# Altium schematic sheet AMU-S04-V00-Microcontroller.SchDoc: AMU Microcontroller
size A3; DrawnBy: Thomas Benedetti; DocumentNumber: 4; Revision: 01; SheetNumber: 5; SheetTotal: 25; Version: 01; Project: AMU 2020; PageSetup: Record=PageOptions|CenterHorizontal=True|CenterVertical=True|PrintScale=0.97|XCorrection=1.00|YCorrection=1.00|PrintKind=0|BorderSize=5000000|LeftOffset=0|BottomOffset=0|Orientation=2|PaperLength=1000|PaperWidth=1000|Scale=100|PaperSource=7|PrintQuality=-4|MediaType=1|DitherType=10|PaperKind=A4|PrintScaleMode=1
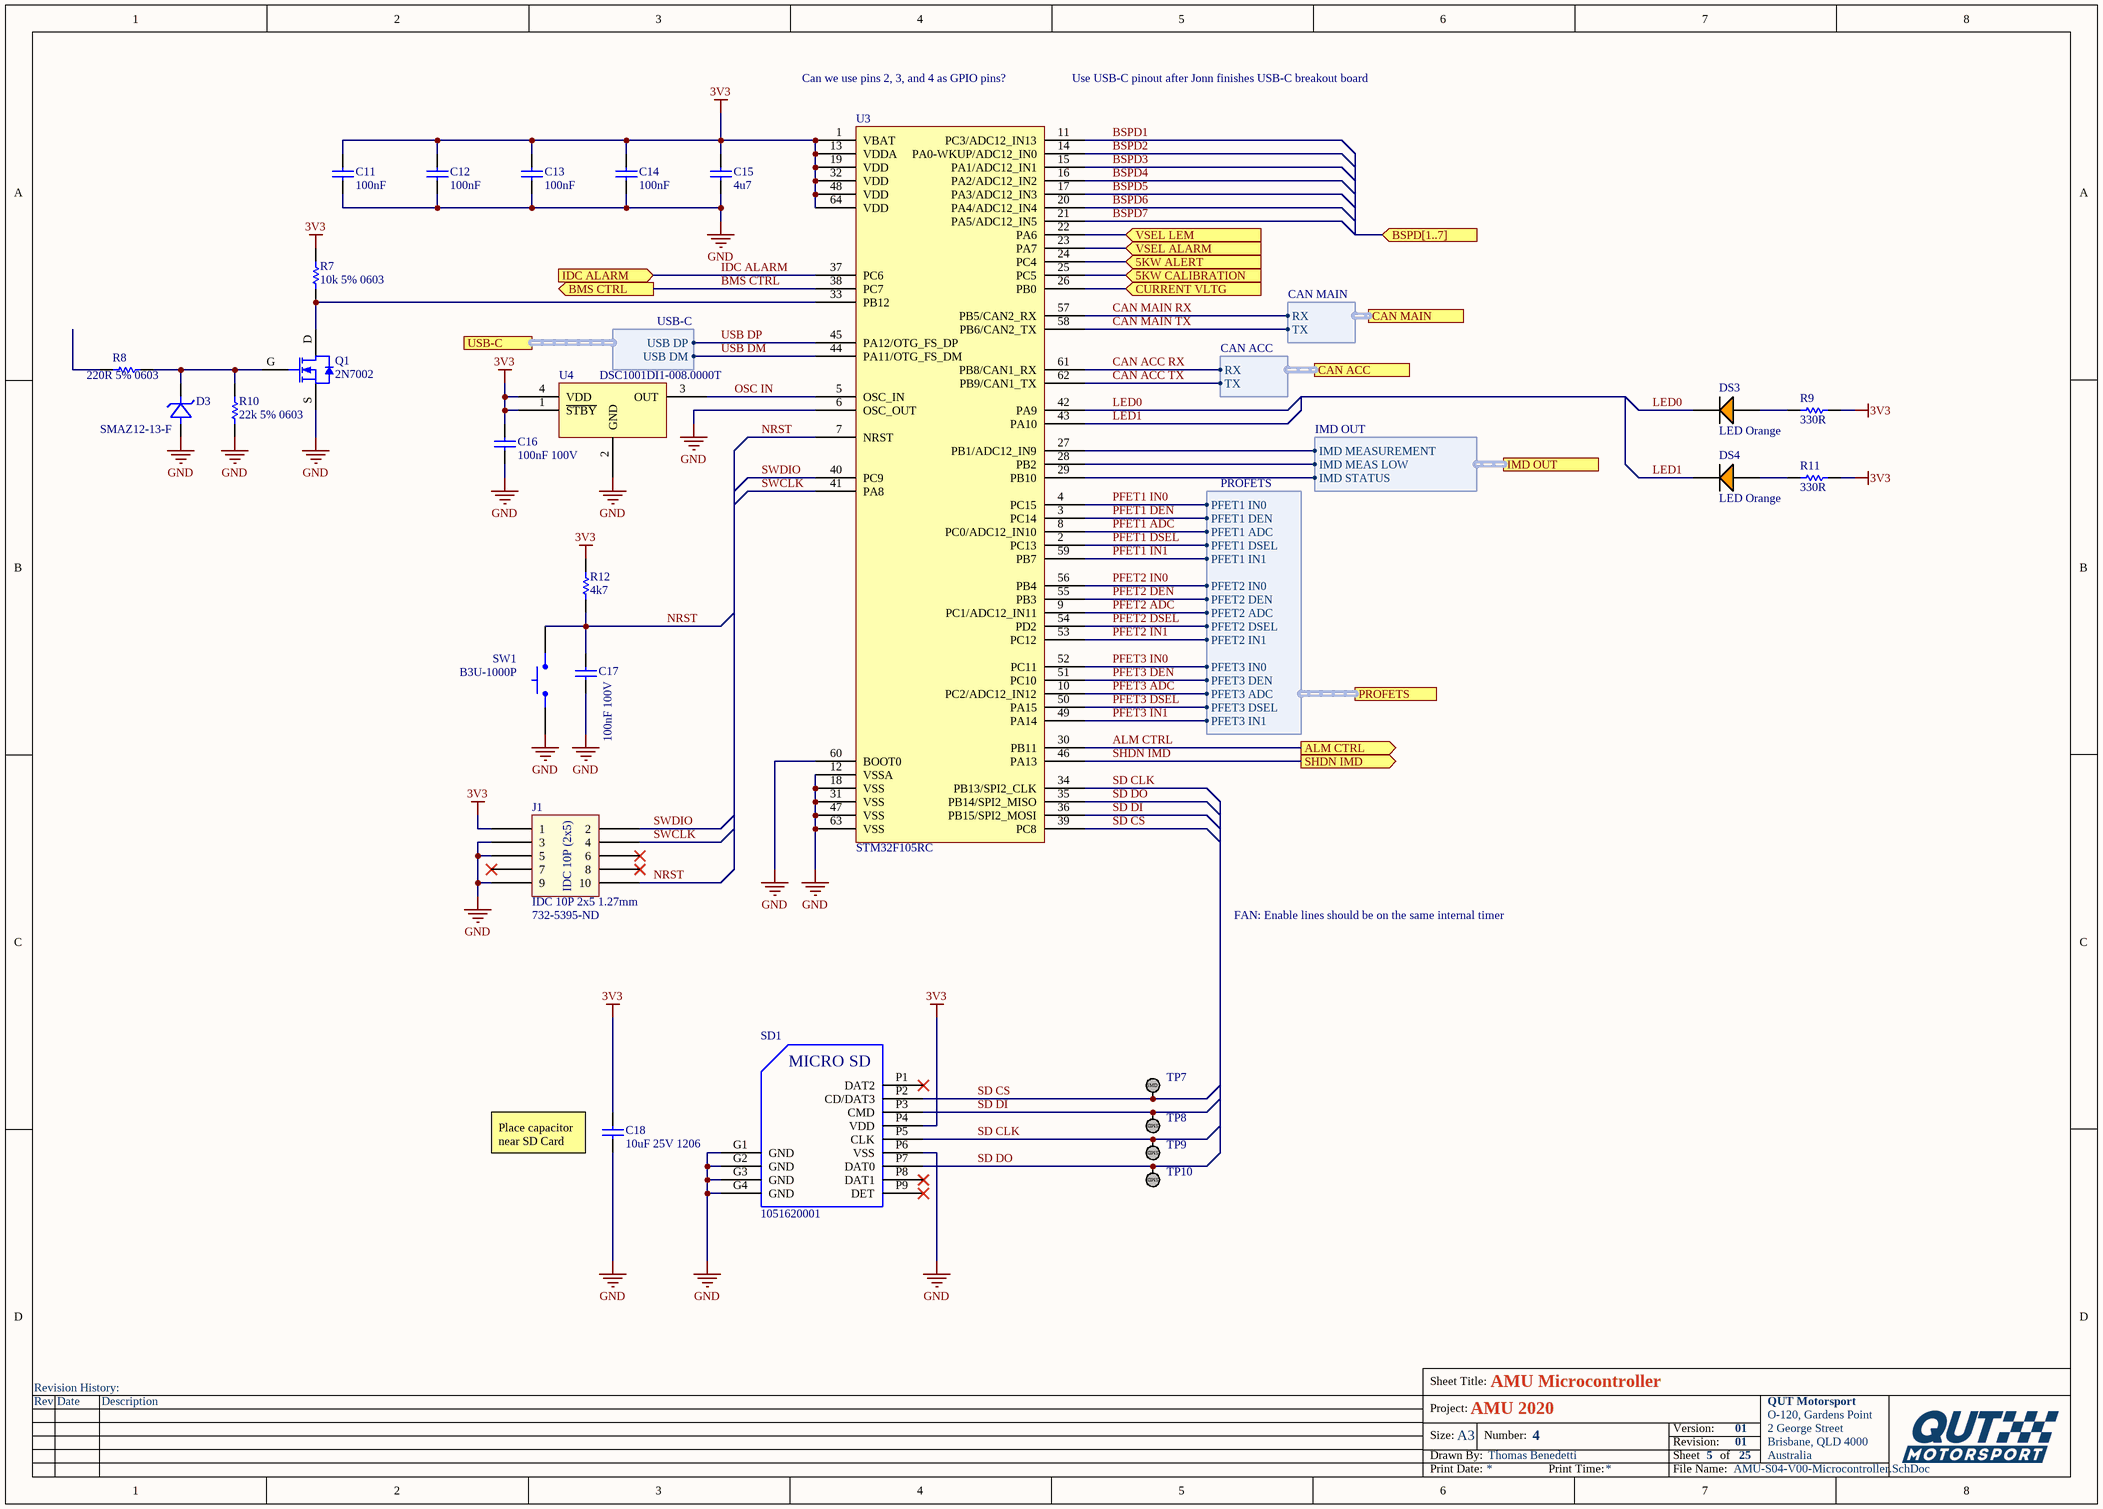
[diagram p0: AMU-S04-V00-Microcontroller.SchDoc]

## Parts
C11  100nF  [Cap_Ceramic_0603]
C12  100nF  [Cap_Ceramic_0603]
C13  100nF  [Cap_Ceramic_0603]
C14  100nF  [Cap_Ceramic_0603]
C15  4u7  [Cap_Ceramic_0603]
C16  100nF 100V  [Cap_Ceramic_0603]
C17  100nF 100V  [Cap_Ceramic_0603]
C18  10uF 25V 1206  [Cap_Ceramic_1206]
D3  SMAZ12-13-F  [SMA]
DS3  LED Orange  [LED ORANGE 0603]
DS4  LED Orange  [LED ORANGE 0603]
J1  IDC 10P 2x5 1.27mm  [IDC 1.27MM 10P]
Q1  2N7002  [SOT23-3]
R7  10k 5% 0603  [Res_ThinFilm_0603]
R8  220R 5% 0603  [Res_ThinFilm_0603]
R9  330R  [Res_ThinFilm_0603]
R10  22k 5% 0603  [Res_ThinFilm_0603]
R11  330R  [Res_ThinFilm_0603]
R12  4k7  [Res_ThinFilm_0603]
SD1  1051620001  [1051620001]
SW1  B3U-1000P  [BTN B3U-1000P]
TP7  TestPoint_SMD  [TestPointSMD]  (value not drawn)
TP8  TestPoint_SMD  [TestPointSMD]  (value not drawn)
TP9  TestPoint_SMD  [TestPointSMD]  (value not drawn)
TP10  TestPoint_SMD  [TestPointSMD]  (value not drawn)
U3  STM32F105RC  [STM32F105RC]
U4  DSC1001DI1-008.0000T  [DSC1001DI1-008.0000TCT-ND]

## Ports
5KW ALERT (in), 5KW CALIBRATION (in), ALM CTRL (out), BMS CTRL (out), BSPD[1..7] (in), CAN ACC (harness CAN ACC), CAN MAIN (harness CAN MAIN), CURRENT VLTG (in), IDC ALARM (in), IMD OUT (harness IMD OUT), PROFETS (harness PROFETS), SHDN IMD (out), USB-C (harness USB-C), VSEL ALARM (in), VSEL LEM (in)

## Harnesses
PROFETS: PFET3 DEN, PFET3 ADC, PFET3 DSEL, PFET2 DEN, PFET2 DSEL, PFET2 ADC, PFET1 DEN, PFET1 ADC, PFET1 DSEL, PFET1 IN0, PFET2 IN0, PFET3 IN0, PFET1 IN1, PFET2 IN1, PFET3 IN1
CAN MAIN: TX, RX
IMD OUT: IMD MEASUREMENT, IMD MEAS LOW, IMD STATUS
CAN ACC: RX, TX
USB-C: USB DP, USB DM

## Nets
3V3: C11.2 C12.2 C13.2 C14.2 C15.2 C16.2 C18.2 J1.1 R7.1 R9.2 R11.2 R12.2 SD1.P4(VDD) U3.1(VBAT) U3.13(VDDA) U3.19(VDD) U3.32(VDD) U3.48(VDD) U3.64(VDD) U4.1(~{STBY}) U4.4(VDD)
GND: C11.1 C12.1 C13.1 C14.1 C15.1 C16.1 C17.1 C18.1 D3.A(Anode) J1.3 J1.5 J1.9 Q1.S R10.1 SD1.G1(GND) SD1.G2(GND) SD1.G3(GND) SD1.G4(GND) SD1.P6(VSS) SW1.1 U3.6(OSC_OUT) U3.12(VSSA) U3.18(VSS) U3.31(VSS) U3.47(VSS) U3.60(BOOT0) U3.63(VSS) U4.2(GND)
5KW ALERT: U3.24(PC4) ; port 5KW ALERT
5KW CALIBRATION: U3.25(PC5) ; port 5KW CALIBRATION
ALM CTRL: U3.30(PB11) ; port ALM CTRL
BMS CTRL: U3.38(PC7) ; port BMS CTRL
BSPD1: U3.11(PC3/ADC12_IN13)
BSPD2: U3.14(PA0-WKUP/ADC12_IN0)
BSPD3: U3.15(PA1/ADC12_IN1)
BSPD4: U3.16(PA2/ADC12_IN2)
BSPD5: U3.17(PA3/ADC12_IN3)
BSPD6: U3.20(PA4/ADC12_IN4)
BSPD7: U3.21(PA5/ADC12_IN5)
CAN ACC RX: U3.61(PB8/CAN1_RX) ; port CAN ACC.RX
CAN ACC TX: U3.62(PB9/CAN1_TX) ; port CAN ACC.TX
CAN MAIN RX: U3.57(PB5/CAN2_RX) ; port CAN MAIN.RX
CAN MAIN TX: U3.58(PB6/CAN2_TX) ; port CAN MAIN.TX
CURRENT VLTG: U3.26(PB0) ; port CURRENT VLTG
IDC ALARM: U3.37(PC6) ; port IDC ALARM
LED0: DS3.2(C) U3.42(PA9)
LED1: DS4.2(C) U3.43(PA10)
NRST: C17.2 J1.10 R12.1 SW1.2 U3.7(NRST)
OSC IN: U3.5(OSC_IN) U4.3(OUT)
PFET1 ADC: U3.8(PC0/ADC12_IN10) ; port PROFETS.PFET1 ADC
PFET1 DEN: U3.3(PC14) ; port PROFETS.PFET1 DEN
PFET1 DSEL: U3.2(PC13) ; port PROFETS.PFET1 DSEL
PFET1 IN0: U3.4(PC15) ; port PROFETS.PFET1 IN0
PFET1 IN1: U3.59(PB7) ; port PROFETS.PFET1 IN1
PFET2 ADC: U3.9(PC1/ADC12_IN11) ; port PROFETS.PFET2 ADC
PFET2 DEN: U3.55(PB3) ; port PROFETS.PFET2 DEN
PFET2 DSEL: U3.54(PD2) ; port PROFETS.PFET2 DSEL
PFET2 IN0: U3.56(PB4) ; port PROFETS.PFET2 IN0
PFET2 IN1: U3.53(PC12) ; port PROFETS.PFET2 IN1
PFET3 ADC: U3.10(PC2/ADC12_IN12) ; port PROFETS.PFET3 ADC
PFET3 DEN: U3.51(PC10) ; port PROFETS.PFET3 DEN
PFET3 DSEL: U3.50(PA15) ; port PROFETS.PFET3 DSEL
PFET3 IN0: U3.52(PC11) ; port PROFETS.PFET3 IN0
PFET3 IN1: U3.49(PA14) ; port PROFETS.PFET3 IN1
SD CLK: SD1.P5(CLK) TP9.1 U3.34(PB13/SPI2_CLK)
SD CS: SD1.P2(CD/DAT3) TP7.1 U3.39(PC8)
SD DI: SD1.P3(CMD) TP8.1 U3.36(PB15/SPI2_MOSI)
SD DO: SD1.P7(DAT0) TP10.1 U3.35(PB14/SPI2_MISO)
SHDN IMD: U3.46(PA13) ; port SHDN IMD
SWCLK: J1.4 U3.41(PA8)
SWDIO: J1.2 U3.40(PC9)
USB DM: U3.44(PA11/OTG_FS_DM) ; port USB-C.USB DM
USB DP: U3.45(PA12/OTG_FS_DP) ; port USB-C.USB DP
VSEL ALARM: U3.23(PA7) ; port VSEL ALARM
VSEL LEM: U3.22(PA6) ; port VSEL LEM
NetD3_K: D3.K(Cathode) Q1.G R8.2 R10.2
NetDS3_1: DS3.1(A) R9.1
NetDS4_1: DS4.1(A) R11.1
NetQ1_D: Q1.D R7.2 U3.33(PB12)
NetU3_27: U3.27(PB1/ADC12_IN9) ; port IMD OUT.IMD MEASUREMENT
NetU3_28: U3.28(PB2) ; port IMD OUT.IMD MEAS LOW
NetU3_29: U3.29(PB10) ; port IMD OUT.IMD STATUS

Not connected (* = marked no-connect by the designer): J1 6* 7* 8*; R8 1; SD1 P1(DAT2)* P8(DAT1)* P9(DET)*

## Notes on the sheet
- Can we use pins 2, 3, and 4 as GPIO pins?
- Use USB-C pinout after Jonn finishes USB-C breakout board
- (near J1) 732-5395-ND
- FAN: Enable lines should be on the same internal timer
- (near C18) Place capacitor near SD Card
- Revision History:
- Sheet Title:
- Rev
- Date
- Description
- Project:
- Size:
- Drawn By:
- A3
- Number:
- Revision:
- Sheet
- Version:
- of
- QUT Motorsport
- O-120, Gardens Point
- 2 George Street
- Brisbane, QLD 4000
- Australia
- Print Date:
- Print Time:
- File Name:
- (in symbol 1051620001) MICRO SD
- (in symbol IDC 10P 2x5 1.27mm) IDC 10P (2x5)
- (in symbol TestPoint_SMD) SMD

## Library data of the parts
C11-C14 = 100nF 50V 5% X7R 0603: Capacitor, Ceramic, SMD, 100nF, 50V, 5%, X7R, 0603
C15 = 4u7 50V 5% X7R 0603: Capacitor, Ceramic, SMD, 4u7, 50V, 5%, X7R, 0603
C16 C17 = 100nF 100V 5% X7R 0603: Capacitor, Ceramic, SMD, 100nF, 100V, 5%, X7R, 0603
C18 = 10uF 25V 10% X7R 1206: Capacitor, Ceramic, SMD, 10uF, 25V, 10%, X7R, 1206
D3 = SMAZ12-13-F: Zener Diode 12V 1W ±5% Surface Mount SMA; ComponentLink1Description: Datasheet:; ComponentLink1URL: https://www.diodes.com/assets/Datasheets/ds18015.pdf
DS3 DS4 = LED ORANGE 0603
R7 = 10k 5% 0603: Resistor, SMD, 10k, 0.1W, 5%, 0603
R8 = 220R 5% 0603: Resistor, SMD, 220R, 0.1W, 5%, 0603
R9 R11 = 330R 5% 0603: Resistor, SMD, 330R, 0.1W, 5%, 0603
R10 = 22k 5% 0603: Resistor, SMD, 22k, 0.1W, 5%, 0603
R12 = 4k7 5% 0603: Resistor, SMD, 4k7, 0.1W, 5%, 0603
SD1 = 1051620001: 9 (8 + 1) Position Card Connector microSD™ Surface Mount, Right Angle Gold; ComponentLink1Description: Digikey; ComponentLink1URL: https://www.digikey.com.au/product-detail/en/molex/1051620001/WM14405CT-ND/6133135; ComponentLink2Description: Datasheet; ComponentLink2URL: https://www.molex.com/pdm_docs/sd/1051620001_sd.pdf
SW1 = BTN B3U-1000P: Omron B3U-1000P Ultra Miniture Switch; ComponentLink1Description: LCSC; ComponentLink1URL: https://lcsc.com/product-detail/Tactile-Switches_BRIGHT-TSA063G50-250_C294565.html
U3 = STM32F105RC: ARM® Cortex®-M3 STM32F1 Microcontroller IC 32-Bit 72MHz 256KB (256K x 8) FLASH 64-LQFP (10x10); ComponentLink1Description: Digikey; ComponentLink1URL: https://www.digikey.com.au/product-detail/en/stmicroelectronics/STM32F105RCT6TR/497-17397-1-ND/8024118; ComponentLink2Description: Datasheet; ComponentLink2URL: https://www.st.com/content/ccc/resource/technical/document/datasheet/e4/f3/1a/89/5a/02/46/ae/CD00220364.pdf/files/CD00220364.pdf/jcr:content/translations/en.CD00220364.pdf
U4 = DSC1001DI1-008.0000T: on 8MHz XO (Standard) CMOS Oscillator 1.8 ~ 3.3V Standby (Power Down) 4-SMD, No Lead